# EasyEDA Pro project ProPrj_bl_fucker_2025-07-29.epro

# Schematic Schematic1
Board Name: Board1; Create Date: 2025-07-29; Page Name: P1; Project Name: bl_fucker; Schematic Name: Schematic1; Update Date: 2025-07-29; Company: 嘉立创EDA; Page Size: A4; Version: V1.0
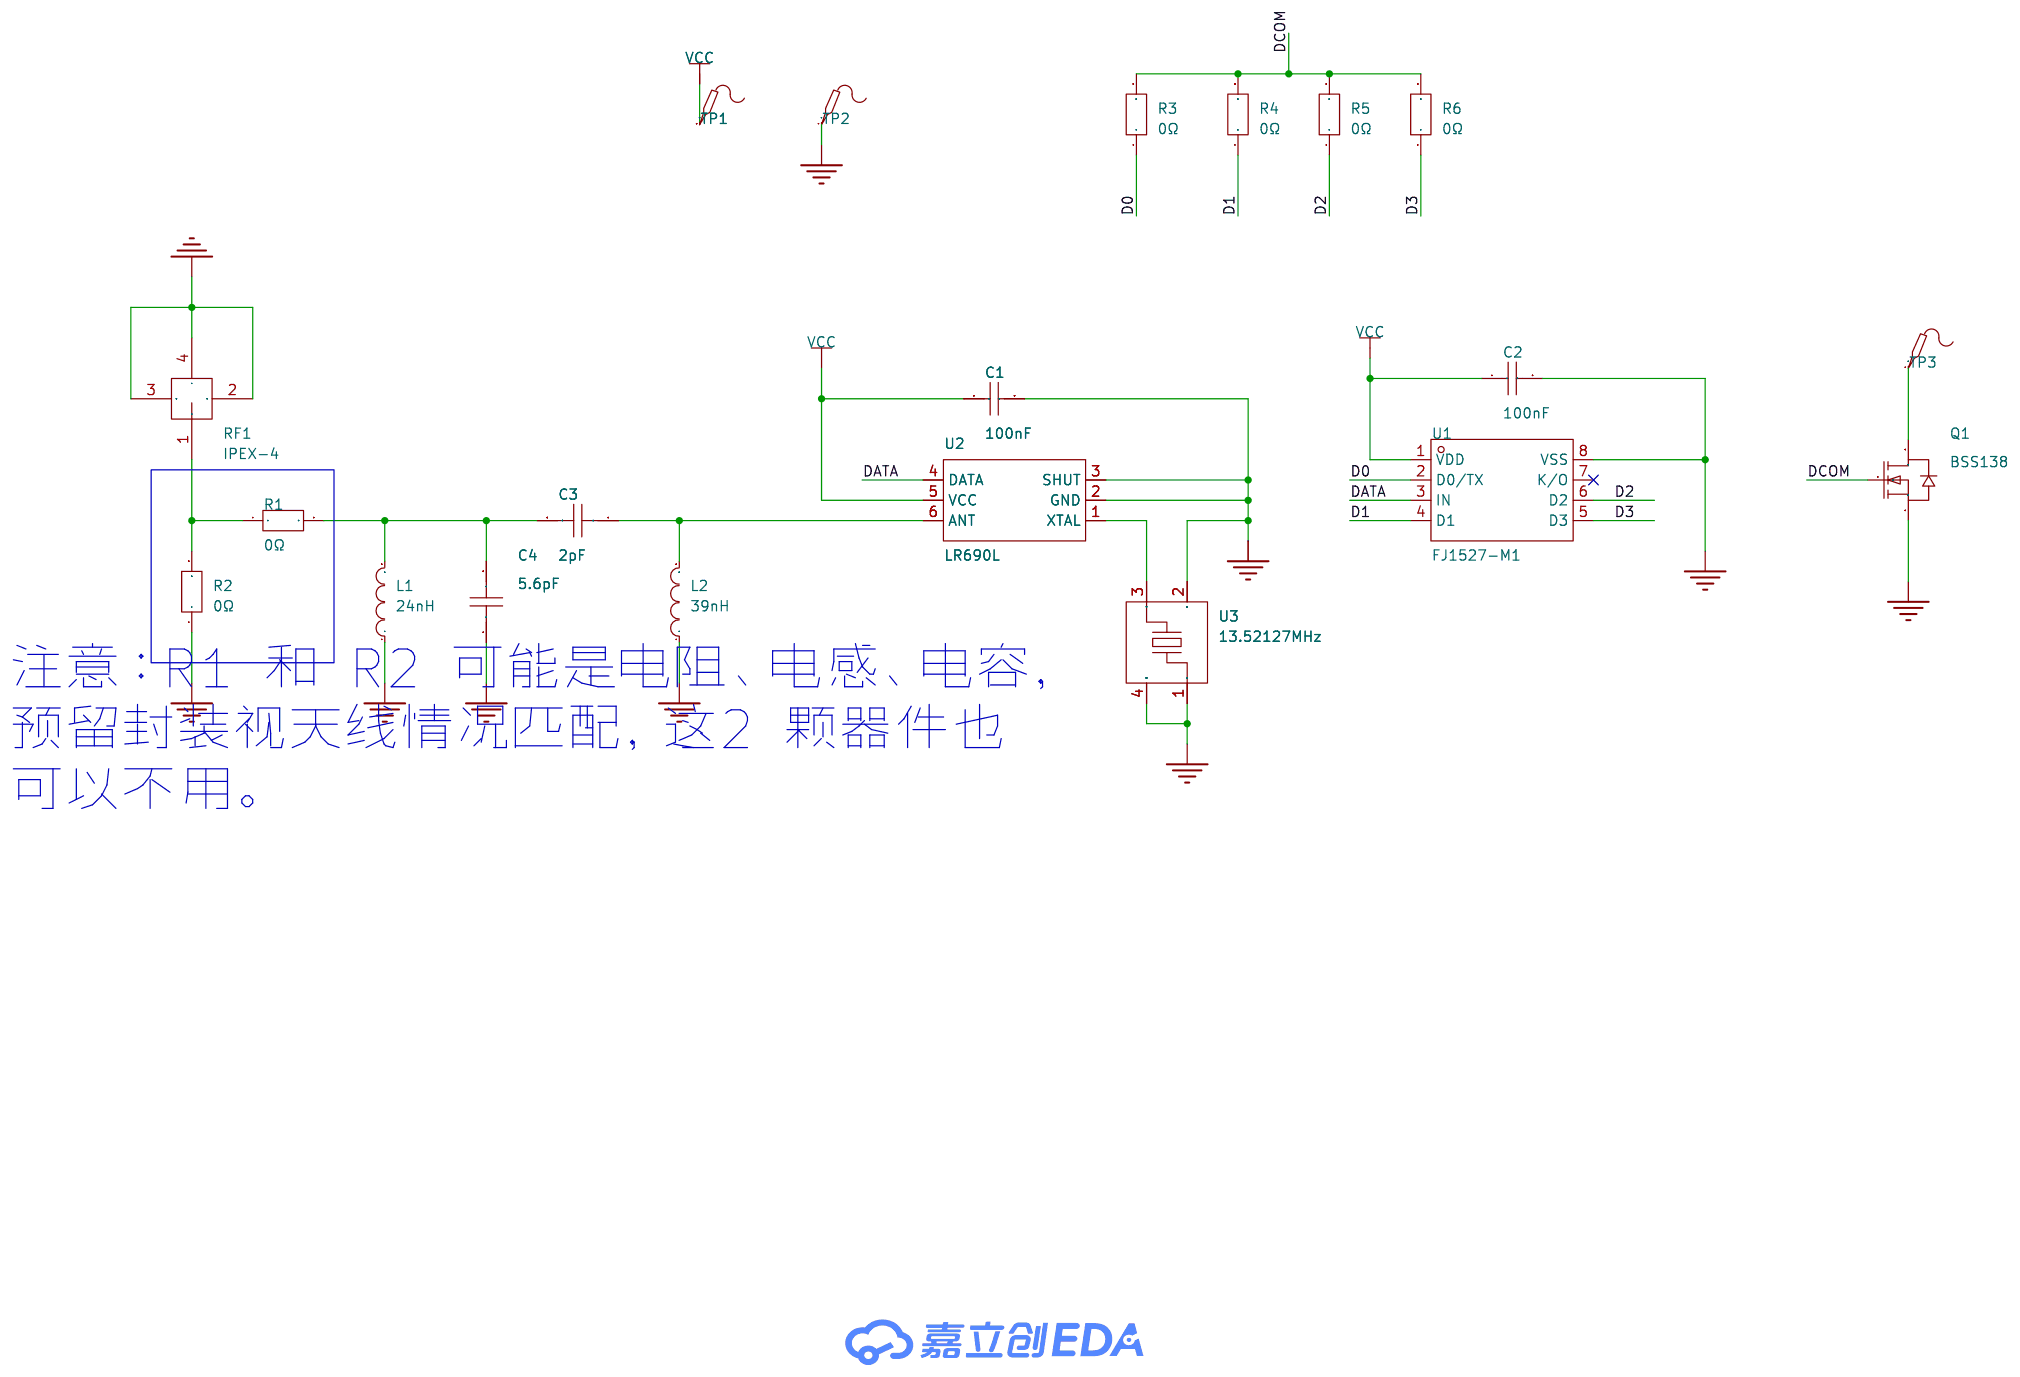
[diagram p0: schematic sheet]

## Parts
C1  100nF  [C0201]
C2  100nF  [C0201]
C3  2pF  [C0201]
C4  5.6pF  [C0201]
L1  24nH  [L0201]
L2  39nH  [L0201]
Q1  BSS138  [SOT-23-3_L2.9-W1.3-P1.90-LS2.4-BR]
R1  0Ω  [R0201]
R2  0Ω  [R0201]
R3  0Ω  [R0201]
R4  0Ω  [R0201]
R5  0Ω  [R0201]
R6  0Ω  [R0201]
RF1  IPEX-4  [IPEX-SMD_4P-L1.8-W1.7-LS2.0]
TP1  -  [Test-Point-0.5mm]
TP2  -  [Test-Point-0.5mm]
TP3  -  [Test-Point-0.5mm]
U1  FJ1527-M1  [SOP-8_L4.9-W3.9-P1.27-LS6.0-BL-1]
U2  LR690L  [SOT-23-6_L2.9-W1.6-P0.95-LS2.8-BL]
U3  13.52127MHz  [CRYSTAL-SMD_4P-L3.2-W2.5-BL]

## Library data of the parts
C1 C2 = GRM033R61E104KE14D: 容值:100nF;精度:±10%;额定电压:25V;温度系数:X5R;; LCSC Part Name: 100nF ±10% 25V; Supplier Part: C76939; Manufacturer: muRata(村田); Supplier Footprint: 0201; JLCPCB Part Class: 扩展库; Datasheet: https://atta.szlcsc.com/upload/public/pdf/source/20180307/C76939_15204091018551407727.pdf; Supplier: LCSC; Tolerance: ±10%; Voltage Rating: 25V; Temperature Coefficient: X5R
C3 = GRM0335C1H2R0BA01D: 容值:2pF;额定电压:50V;材质(温度系数):C0G;; LCSC Part Name: 2pF 50V; Supplier Part: C161419; Manufacturer: muRata(村田); Supplier Footprint: 0201; JLCPCB Part Class: 扩展库; Datasheet: https://atta.szlcsc.com/upload/public/pdf/source/20181011/C161419_FCC558F9087F8092274634DE7D4FDE99.pdf; Supplier: LCSC; Voltage Rated: 50V; Temperature Coefficient: C0G
C4 = CQ0201BRNPO8BN5R6: 容值:5.6pF;额定电压:25V;材质(温度系数):NP0;; LCSC Part Name: 5.6pF 25V; Supplier Part: C577364; Manufacturer: YAGEO(国巨); Supplier Footprint: 0201; JLCPCB Part Class: 扩展库; Datasheet: https://atta.szlcsc.com/upload/public/pdf/source/20231121/A01A80700FEB9068741B58614490A5F9.pdf; Supplier: LCSC; Voltage Rated: 25V; Temperature Coefficient: NP0
L1 = LQP03TN24NH02D: 电感值:24nH;精度:±3%;额定电流:140mA;饱和电流(Isat):-;直流电阻(DCR):2.3Ω;; LCSC Part Name: 24nH ±3%; Supplier Part: C206441; Manufacturer: muRata(村田); Supplier Footprint: 0201; JLCPCB Part Class: 扩展库; Datasheet: https://atta.szlcsc.com/upload/public/pdf/source/20200107/C157592_7FF58F85BAEF0D918ADFA12AEC0AEBA8.pdf; Supplier: LCSC; Tolerance: ±3%; Rated Current: 140mA; DC Resistance (DCR): 2.3Ω; Q @ Freq: 12@500MHz; Frequency - Self Resonant: 2GHz; Type: 厚膜电感
L2 = VHF060303HQ39NKT: 电感值:39nH;精度:±10%;额定电流:100mA;饱和电流(Isat):-;直流电阻(DCR):2.3Ω;; LCSC Part Name: 39nH ±10%; Supplier Part: C381792; Manufacturer: FH(风华); Supplier Footprint: 0201; JLCPCB Part Class: 扩展库; Datasheet: https://atta.szlcsc.com/upload/public/pdf/source/20230223/B98D976865A69D6B3D72BAFD98F60EE7.pdf; Supplier: LCSC; Tolerance: ±10%; Rated Current: 100mA; DC Resistance (DCR): 2.3Ω
Q1 = BSS138_C7420339: 类型:1个N沟道;漏源电压(Vdss):50V;连续漏极电流(Id):340mA;导通电阻(RDS(on)):2.5Ω@10V,340mA;耗散功率(Pd):350mW;阈值电压(Vgs(th)):1.6V;; LCSC Part Name: N沟道,电流:340mA,耐压:50V; Supplier Part: C7420339; Manufacturer: 宏嘉诚; Supplier Footprint: SOT-23; JLCPCB Part Class: 扩展库; Datasheet: https://atta.szlcsc.com/upload/public/pdf/source/20250106/6679E24F3D42D0BF4A4F6E14986335A4.pdf; Supplier: LCSC; Type: 1个N沟道; Drain to Source Voltage: 50V; Current - Continuous Drain(Id): 340mA; RDS(on): 2.5Ω@10V,340mA; Pd - Power Dissipation: 350mW; Gate Threshold Voltage (Vgs(th)@Id): 1.6V; Gate Charge(Qg): 1.7nC@10V; Input Capacitance(Ciss@Vds): 17.5pF@25V; Reverse Transfer Capacitance (Crss@Vds): 6.5pF@25V; Operating Temperature: -55℃~+150℃
R1-R6 = 0201WMF0000TEE: 电阻类型:厚膜电阻;阻值:0Ω;精度:±1%;功率:50mW;工作电压:25V;; LCSC Part Name: 0Ω ±1% 50mW 厚膜电阻; Supplier Part: C473473; Manufacturer: UNI-ROYAL(厚声); Supplier Footprint: 0201; JLCPCB Part Class: 扩展库; Datasheet: https://atta.szlcsc.com/upload/public/pdf/source/20200306/C422600_1E6D84923E4A46A82E41ADD87F860B5C.pdf; Supplier: LCSC; Type: 厚膜电阻; Tolerance: ±1%; Power(Watts): 50mW; Voltage-Supply(Max): 25V; Operating Temperature: -55℃~+155℃
RF1 = IPEX-4: 射频系列:IPEX;; LCSC Part Name: IPEX; Supplier Part: C2987683; Manufacturer: Ziisor(致哲); Supplier Footprint: SMD; JLCPCB Part Class: 扩展库; Supplier: LCSC; RF Series: IPEX
TP1-TP3 = Test-Point: Test Point 测试点
U1 = FJ1527-M1: RF遥控专用解码芯片; LCSC Part Name: RF遥控专用解码芯片; Supplier Part: C5182316; Manufacturer: 蜂鸟无线; Supplier Footprint: SOP-8; JLCPCB Part Class: 扩展库; Datasheet: https://atta.szlcsc.com/upload/public/pdf/source/20220929/1A5669C68F85C805BCE5C55ADB41C512.pdf; Supplier: LCSC
U2 = LR690L: 频率范围:300MHz~440MHz;灵敏度:-110dBm;; Supplier Part: C2857840; Manufacturer: 蜂鸟无线; Supplier Footprint: SOT-23-6; JLCPCB Part Class: 扩展库; Datasheet: https://atta.szlcsc.com/upload/public/pdf/source/20240823/25F3FF4F1A996272B211D00AA736FA7E.pdf; Supplier: LCSC; Frequency Range: 300MHz~440MHz; Voltage - Supply: 2V~5.5V; Sensitivity: -110dBm; Receive Current: 2.8mA; Operating Temperature: -40℃~+125℃
U3 = TAXM13.52127M4RLBDDT2T: 晶振类型:贴片晶振;频率:13.52127MHz;常温频差:±10ppm;负载电容:20pF;频率稳定度:±20ppm;; LCSC Part Name: 13.52127MHz ±10ppm 20pF; Supplier Part: C2997669; Manufacturer: YJX(雅晶鑫); Supplier Footprint: SMD3225-4P; JLCPCB Part Class: 扩展库; Datasheet: https://atta.szlcsc.com/upload/public/pdf/source/20220419/84E91897B08B8726E21BCD42AB78D2F5.pdf; Supplier: LCSC; Type: 贴片晶振; Normal temperature Frequency Tolerance: ±10ppm; Load Capacitance: 20pF; Frequency Stability: ±20ppm; Equivalent Series Resistance(ESR): 55Ω; Operating Temperature: -30℃~+85℃

## Nets
GND: C1.2 C2.2 C4.1 L1.1 L2.1 Q1.2(S) R2.1 RF1.2 RF1.3 RF1.4 TP2.1 U1.8(VSS) U2.2(GND) U2.3(SHUT) U3.1 U3.2(GND) U3.4(GND)
VCC: C1.1 C2.1 TP1.1 U1.1(VDD) U2.5(VCC)
D0: R3.1 U1.2(D0/TX)
D1: R4.1 U1.4(D1)
D2: R5.1 U1.6(D2)
D3: R6.1 U1.5(D3)
DATA: U1.3(IN) U2.4(DATA)
DCOM: Q1.1(G) R3.2 R4.2 R5.2 R6.2
$1N694: U2.1(XTAL) U3.3
$1N968: C3.1 L2.2 U2.6(ANT)
$1N1264: C3.2 C4.2 L1.2 R1.2
$1N1430: R1.1 R2.2 RF1.1
Net-(Q1-3): Q1.3(D) TP3.1

Not connected (* = marked no-connect by the designer): U1 7(K/O)*

## Notes on the sheet
- 注意：R1 和 R2 可能是电阻、电感、电容，
  预留封装视天线情况匹配，这2 颗器件也
  可以不用。

# Board PCB1
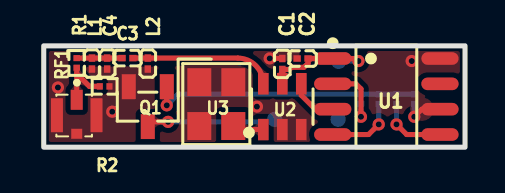
[diagram p1: board, top side]
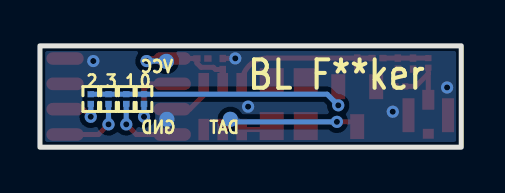
[diagram p2: board, bottom side, seen from below]

Outline 21.08 x 5.08 mm; copper layers: Top Layer, Bottom Layer. Coordinates in mm from the lower left corner of the outline.
Outline path: rectangle 0,5.08 21.08,0
Stack: Top Layer 0.035mm / Dielectric1 0.51mm FR4 er 4.5 / Bottom Layer 0.035mm

## Design rules (mm)
template: 自定义配置
spacing copperThickness1oz (default): track to track 0.102, other pairs 0.152 to 0.3
spacing copperThickness2oz: track to track 0.203, other pairs 0.152 to 0.3
track width copperThickness1oz (default): min 0.127, default 0.254, max 2.54
track width copperThickness2oz: min 0.203, default 0.254, max 2.54
differential pair differentialPair (default): width min 0.127, default 0.254, max 2.54; gap min 0.152, default 0.152
via viaSize (default): diameter min 0.5, default 0.61, max 10; hole min 0.3, default 0.305, max 6.3
net GND uses copperRegion1
pour e174 uses copperRegion1

## Placement (name value [footprint] x y rotation side)
0  0Ω  [R0201]  15.88 2.41 90 bottom
1  0Ω  [R0201]  16.76 2.41 90 bottom
2  0Ω  [R0201]  18.54 2.41 90 bottom
3  0Ω  [R0201]  17.65 2.41 90 bottom
C1  100nF  [C0201]  11.94 4.17 90 top
C2  100nF  [C0201]  12.95 4.44 180 top
C3  2pF  [C0201]  4.19 4.47 180 top
C4  5.6pF  [C0201]  3.18 4.19 90 top
DAT  -  [Test-Point-0.5mm]  11.56 1.4 0 top
GND  -  [Test-Point-0.5mm]  14.73 1.4 0 top
L1  24nH  [L0201]  2.41 4.19 90 top
L2  39nH  [L0201]  5.21 4.19 90 top
Q1  BSS138  [SOT-23-3_L2.9-W1.3-P1.90-LS2.4-BR]  5.21 2.03 90 top
R1  0Ω  [R0201]  1.65 4.22 90 top
R2  0Ω  [R0201]  3.05 3.05 180 top
RF1  IPEX-4  [IPEX-SMD_4P-L1.8-W1.7-LS2.0]  1.65 1.52 180 top
U1  FJ1527-M1  [SOP-8_L4.9-W3.9-P1.27-LS6.0-BL-1]  17.15 2.54 270 top
U2  LR690L  [SOT-23-6_L2.9-W1.6-P0.95-LS2.8-BL]  11.94 2.03 0 top
U3  13.52127MHz  [CRYSTAL-SMD_4P-L3.2-W2.5-BL]  8.64 2.16 270 top
VCC  -  [Test-Point-0.5mm]  14.76 4.3 0 top

## Footprints (pads in the part's own frame, mm; a bottom-side part is the same pattern mirrored in y, then rotated)
C0201
  rect 0.368x0.324 smd: 1(-0.275,0) 2(0.275,0)
CRYSTAL-SMD_4P-L3.2-W2.5-BL
  rect 1.4x1.2 smd: 1(-1.1,-0.85) 2(1.1,-0.85) 3(1.1,0.85) 4(-1.1,0.85)
IPEX-SMD_4P-L1.8-W1.7-LS2.0
  rect 0.6x1 smd: 1(0.001,-0.852)
  rect 0.6x1.7 smd: 2(0.99,-0.077) 4(-0.99,-0.077)
  rect 0.55x0.5 smd: 3(0.001,0.852)
L0201
  rect 0.368x0.324 smd: 1(-0.275,0) 2(0.275,0)
R0201
  rect 0.303x0.324 smd: 1(-0.241,0) 2(0.241,0)
SOP-8_L4.9-W3.9-P1.27-LS6.0-BL-1
  oval 0.63x1.865 smd: 1(-1.905,-2.683) 2(-0.635,-2.683) 3(0.635,-2.683) 4(1.905,-2.683) 5(1.905,2.683) 6(0.635,2.683) 7(-0.635,2.683) 8(-1.905,2.683)
SOT-23-3_L2.9-W1.3-P1.90-LS2.4-BR
  rect 1.25x0.7 smd: 1(1,-0.95) 2(1,0.95) 3(-1,0)
SOT-23-6_L2.9-W1.6-P0.95-LS2.8-BL
  rect 0.532x1.072 smd: 1(-0.95,-1.149) 2(0,-1.149) 3(0.95,-1.149) 4(0.95,1.149) 5(0,1.149) 6(-0.95,1.149)
Test-Point-0.5mm
  round 0.762 smd far side: 1(0,0)

## Nets
GND: C1.2 C2.2 C4.1 GND.1 L1.1 L2.1 Q1.2 R2.1 RF1.2 RF1.3 RF1.4 U1.8 U2.2 U2.3 U3.1 U3.2 U3.4
VCC: C1.1 C2.1 U1.1 U2.5 VCC.1
D0: 0.1 U1.2
D1: 1.1 U1.4
D2: 2.1 U1.6
D3: 3.1 U1.5
DATA: U1.3 U2.4
DCOM: 0.2 1.2 2.2 3.2 Q1.1
$1N694: U2.1 U3.3
$1N968: C3.1 L2.2 U2.6
$1N1264: C3.2 C4.2 L1.2 R1.2
$1N1430: R1.1 R2.2 RF1.1
$1N2626: DAT.1 Q1.3

Pads without a net: U1 7

## Via types
v1: diameter 0.61, hole 0.305, Top Layer to Bottom Layer, 12 vias

## Routing (per net, layer and track width the routed paths; a pad name or vN(x,y) marks a point on that pad's centre or on a via; arc(x,y) is an arc through that point)
GND: length 0.6
  Top Layer w0.254: v1(11.31,4.45) 11.93,4.45 11.94,4.44
  vias: v1(0.71,2.99) v1(3.43,1.78) v1(10.67,2.03) v1(18.42,4.32)
VCC: length 5.9
  Top Layer w0.254: v1(15.75,4.32) 15.62,4.44 C2.1 13.23,4.21 13.02,4 12.41,4 12.3,3.9 C1.1 U2.5
  Bottom Layer w0.254: v1(15.75,4.32) 14.78,4.32 VCC.1
D0: length 3.6
  Top Layer w0.254: v1(15.88,1.52) 15.88,2.92 15.62,3.17 U1.2
  Bottom Layer w0.254: 0.1 v1(15.88,1.52)
D1: length 3.5
  Top Layer w0.254: U1.4 16.26,0.64 v1(16.76,1.14)
  Bottom Layer w0.254: 1.1 v1(16.76,1.14)
D2: length 2.1
  Top Layer w0.254: U1.6 18.92,1.91 v1(18.54,1.52)
  Bottom Layer w0.254: 2.1 v1(18.54,1.52)
D3: length 3.4
  Top Layer w0.254: U1.5 18.16,0.64 v1(17.65,1.14)
  Bottom Layer w0.254: 3.1 v1(17.65,1.14)
DATA: length 2.4
  Top Layer w0.254: U1.3 13.59,1.91 12.89,2.61 U2.4
DCOM: length 13.5
  Top Layer w0.254: v1(6.16,2.1) Q1.1
  Bottom Layer w0.254: v1(6.16,2.1) 6.71,2.65 0.2 1.2 3.2 2.2
$1N694: length 1.6
  Top Layer w0.254: U3.3 9.66,0.88 U2.1
$1N968: length 7.3
  Top Layer w0.254: C3.1 L2.2 9.72,4.47 arc(10.62,4.08) U2.6
$1N1264: length 2.3
  Top Layer w0.254: C3.2 C4.2 L1.2 R1.2
$1N1430: length 3
  Top Layer w0.254: 1.65,3.68 RF1.1 ; 1.65,3.68 2.29,3.05 R2.2 ; 1.65,3.68 R1.1
$1N2626: length 6.5
  Top Layer w0.254: v1(6.22,1.27) 5.45,1.27 Q1.3
  Bottom Layer w0.254: DAT.1 11.43,1.27 v1(6.22,1.27)

## Copper pours and planes (outline as drawn; the poured copper is in the pictures)
GND on Top Layer: -0.76,5.97 21.72,5.97 21.72,-0.76 -0.76,-0.76
GND on Bottom Layer: -0.63,5.59 21.72,5.59 21.72,-0.76 -0.63,-0.76

Small or netless copper shapes (teardrops, artwork), in the pictures only: 35 on Top Layer, 13 on Bottom Layer

## Text on the board
Bottom Silkscreen Layer: BL F**ker
